# Altium schematic sheet Battery_Module.SchDoc
size A4; SheetNumber: 1; SheetTotal: 1
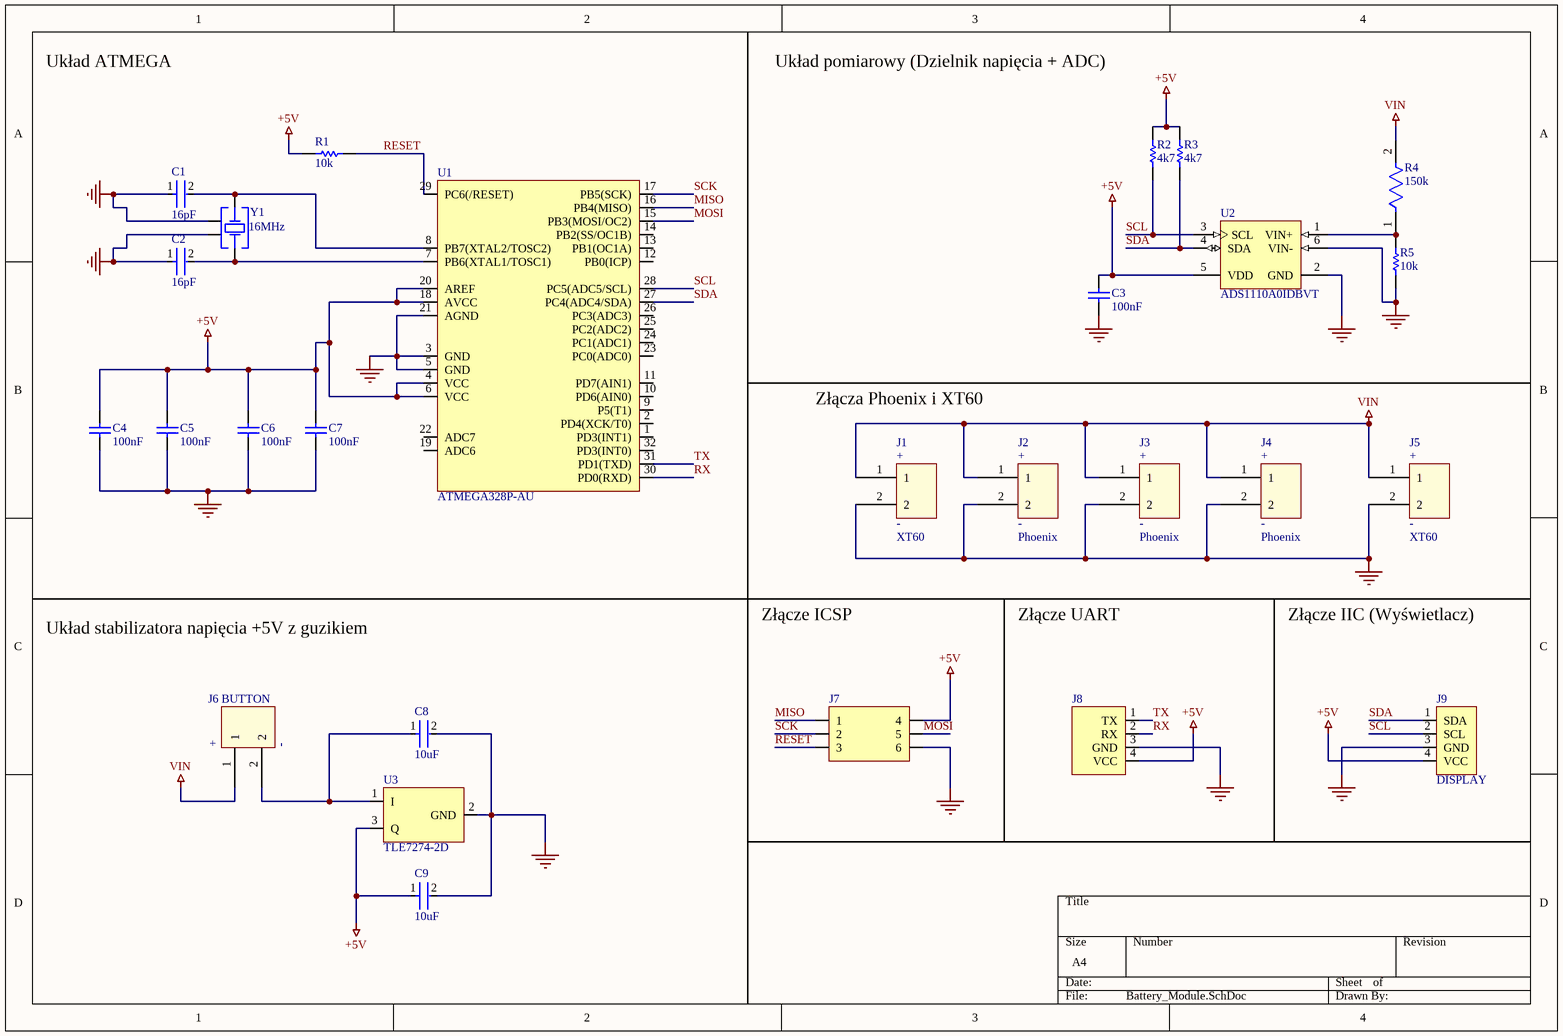
[diagram p0: Battery_Module.SchDoc]

## Parts
C1  16pF  [FP-C0805C-DN-IPC_A]
C2  16pF  [FP-C0805C-DN-IPC_A]
C3  100nF  [CAPC2013X140X50ML20T25]
C4  100nF  [CAPC2013X140X50ML20T25]
C5  100nF  [CAPC2013X140X50ML20T25]
C6  100nF  [CAPC2013X140X50ML20T25]
C7  100nF  [CAPC2013X140X50ML20T25]
C8  10uF  [FP-GRM21B-0_1-IPC_A]
C9  10uF  [FP-GRM21B-0_1-IPC_A]
J1  XT60  [XT60_FEMALE_PANEL]
J2  Phoenix  [Phoenix]
J3  Phoenix  [Phoenix]
J4  Phoenix  [Phoenix]
J5  XT60  [XT60_FEMALE_PANEL]
J6  BUTTON  [HEADER1x2]
J7  (no value)  [Header2x3 - duplicate]
J8  (no value)  [Header1x4]
J9  DISPLAY  [Header1x4]
R1  10k  [RESC2013X60X35ML10T20]
R2  4k7  [YAGO-RC0805_M]
R3  4k7  [YAGO-RC0805_M]
R4  150k  [FP-ERA6A-MFG]
R5  10k  [RESC2013X60X35ML10T20]
U1  ATMEGA328P-AU  [ATMEGA328P-AU]
U2  ADS1110A0IDBVT  [TI-DBV6_N]
U3  TLE7274-2D  [TO228P998X235-3N-2-V]
Y1  16MHz  [WE-XTAL_CFPX-180]

## Nets
+5V: C3.2 C4.1 C5.1 C6.1 C7.1 C9.1 J7.4 J8.4(VCC) J9.4(VCC) R1.2 R2.2 R3.2 U1.4(VCC) U1.6(VCC) U1.18(AVCC) U1.20(AREF) U2.5(VDD) U3.3(Q)
GND: C1.1 C2.1 C3.1 C4.2 C5.2 C6.2 C7.2 C8.2 C9.2 J1.2 J2.2 J3.2 J4.2 J5.2 J7.6 J8.3(GND) J9.3(GND) R5.1 U1.3(GND) U1.5(GND) U1.21(AGND) U2.2(GND) U2.6(VIN-) U3.2(GND) Y1.2(GND&Lid) Y1.4(GND&Lid)
VIN: J1.1 J2.1 J3.1 J4.1 J5.1 J6.1 R4.2
MISO: J7.1 U1.16(PB4(MISO))
MOSI: J7.5 U1.15(PB3(MOSI/OC2))
RESET: J7.3 R1.1 U1.29(PC6(/RESET))
RX: J8.2(RX) U1.30(PD0(RXD))
SCK: J7.2 U1.17(PB5(SCK))
SCL: J9.2(SCL) R2.1 U1.28(PC5(ADC5/SCL)) U2.3(SCL)
SDA: J9.1(SDA) R3.1 U1.27(PC4(ADC4/SDA)) U2.4(SDA)
TX: J8.1(TX) U1.31(PD1(TXD))
NetC1_2: C1.2 U1.8(PB7(XTAL2/TOSC2)) Y1.1(Crystal)
NetC2_2: C2.2 U1.7(PB6(XTAL1/TOSC1)) Y1.3(Crystal)
NetC8_1: C8.1 J6.2 U3.1(I)
NetR4_1: R4.1 R5.2 U2.1(VIN+)

Not connected (* = marked no-connect by the designer): U1 1(PD3(INT1)) 2(PD4(XCK/T0)) 9(P5(T1)) 10(PD6(AIN0)) 11(PD7(AIN1)) 12(PB0(ICP)) 13(PB1(OC1A)) 14(PB2(SS/OC1B)) 19(ADC6) 22(ADC7) 23(PC0(ADC0)) 24(PC1(ADC1)) 25(PC2(ADC2)) 26(PC3(ADC3)) 32(PD3(INT0))

## Notes on the sheet
- Układ ATMEGA
- Układ pomiarowy (Dzielnik napięcia + ADC)
- Złącza Phoenix i XT60
- Układ stabilizatora napięcia +5V z guzikiem
- Złącze ICSP
- Złącze UART
- Złącze IIC (Wyświetlacz)
- (in symbol Connector_2) +; -

## Library data of the parts
C1 C2 = CMP-03020-014624-1: C0805C160J5GACTU / CAP CER 16PF 50V NP0 0805; Manufacturer: KEMET; Temperature Coefficient: 30ppm/°C; Material: Ceramic; Tolerance: 0.05; Temperature Characteristic: C0G; RoHS: TRUE; Category: Cap; Manufacturer Part Number: C0805C160J5GACTU; Mouser Description: Capacitor, Ceramic, 16Pf, 50Vdc, 5-% Tol, 5+% Tol, C0g-Tc Code, -30, 30Ppm-Tc Rohs Compliant: Yes; Temperature: -55°C to +125°C; Digikey Description: CAP CER 16PF 50V NP0 0805; Value: 16 pF; ComponentLink2Description: Datasheet; Ipc Land Pattern Name: CAPC200125X78; Capacitance: 16 pF; Package: C0805C-DN; Device Class L1: Passive Components; Temperature Range High: +125°C; Automotive: No; Height: 0.88mm; ComponentLink2URL: https://content.kemet.com/datasheets/KEM_C1003_C0G_SMD.pdf; Octopart: https://octopart.com/c0805c160j5gactu-kemet-11800741; Lead Free: Yes; Device Class L2: Capacitors; Temperature Range Low: -55°C; Voltage Rating: 50 V; Device Class L3: Ceramic Capacitors
C3-C7 = CMP-2007-04784-1: Manufacturer: AVX Interconnect / Elco; Part Number: 08055F104KAT2A
C8 C9 = CMP-2007-03462-2: Chip Multilayer Ceramic Capacitors for General Purpose, 0805, 10uF, X6S, 22%, 10%, 10V; Width: 1.25mm; Height: 1.25mm; Case Code (Metric): 2012; REACH SVHC: No SVHC; Depth: 1.25mm; Dielectric: X6S; Max Operating Temperature: 105°C; Lead Free: Lead Free; Voltage Rating (DC): 10V; Material: Ceramic; Termination: SMD/SMT; Thickness: 0.053inch; Case/Package: 0805; Mount: Surface Mount; Voltage: 10V; Packaging: Tape and Reel; Package Quantity: 3000; Capacitance: 10uF; Radiation Hardening: No; Voltage Rating: 10V; Length: 2mm; Tolerance: 10%; Min Operating Temperature: -55°C; Case Code (Imperial): 0805
J1-J6 = Connector_2
J7 = Header 2x3
J8 = UART
J9 = IIC for Display
R1 R5 = CMP-1659-00013-4: RC0805FR-0710KL / Chip Resistor, 10 KOhm, +/- 1%, 0.125 W, -55 to 155 degC, 0805 (2012 Metric), RoHS, Tape and Reel; Manufacturer: Yageo; Voltage Rating: 150 V; Mount: Surface Mount; ComponentLink1Description: Manufacturer URL; ComponentLink2URL: http://www.yageo.com/documents/recent/PYu-RC_Group_51_RoHS_L_04.pdf; Pins: 2; Length: 2 mm; Min Operating Temperature: -55 degC; Height: 0.5 mm; Mounting Technology: Surface Mount; RoHSCompliant: true; REACH SVHC: No SVHC; ComponentLink1URL: http://www.yageo.com/; Max Operating Temperature: 155 degC; PackageReference: 0805; DatasheetVersion: Rev. 4, 02/2016; Package Quantity: 5000; Packaging: Tape and Reel; ComponentLink2Description: Datasheet; PackageDescription: 2-Pin Surface Mounted Device, Body 2 x 1.25 mm
R2 R3 = CMP-1568-00001-1: RC0805FR-074K7L / General Puprose Chip Resistor, 4700 Ohm +/- 1%, 0.125 W, -55 to 155 degC, 2-Pin SMD, RoHS, Tape and Reel; Tolerance: +/- 1%; Power: 0.125 W; PackageDescription: 2-Pin Surface Mount Device, Body 2 x 1.25 mm; ComponentLink2URL: http://www.yageo.com/documents/recent/PYu-RC_Group_51_RoHS_L-3.pdf; Temperature Min: -55 degC; Packing: Tape and Reel; Mounting Technology: Surface Mount; PartNumber: RC0805FR-074K7L; ComponentLink1URL: http://www.yageo.com/NewPortal/_en/index.jsp; Resistance: 4700 Ohm; Temperature Max: 155 degC; ComponentLink2Description: Datasheet; DatasheetVersion: Rev. 3; RoHS: TRUE; ComponentLink1Description: Manufacturer URL
R4 = CMP-2001-00599-2: ERA-6AEB154V / RES 150K OHM 0.1% 1/8W 0805; Voltage Rating: 100V; Power Rating: 125mW; Resistance: 150kR; Temperature Coefficient: 25ppm/°C; Termination: SMD/SMT; Number of Terminations: 2; Case Code (Metric): 2012; Number of Pins: 2; Radiation Hardening: No; Technology: METAL FILM; Construction: Rectangular; Contact Plating: Tin; Width: 1.25mm; Resistor Type: Thin Film; Length: 2mm; Max Power Dissipation: 125mW; Mount: Surface Mount; REACH SVHC: No SVHC; Packaging: Tape and Reel; Min Operating Temperature: -55°C; Lead Free: Lead Free; Resistance Tolerance: 0.1%; Depth: 1.25mm; RoHS Compliant: Yes; Military Standard: Not; Max Operating Temperature: 155°C; Package Quantity: 5000; Series: ERA-6A; Height: 0.5mm; Case Code (Imperial): 0805; Tolerance: 0.1%; Voltage Rating (DC): 100V; Case/Package: 0805
U1 = ATMEGA328P-AU: 8-bit Microcontrollers - MCU 32KB In-system Flash 20MHz 1.8V-5.5V
U2 = CMP-0003-00281-2: 16-Bit Delta-Sigma ADC with Internal Reference, PGA and Oscillator, I2C Serial Interface, -40 to 85 degC, 6-pin SOT23 (DBV6), Green (RoHS & no Sb/Br); Manufacturer: Texas Instruments; SubFamily: Precision ADC (<=10MSPS); Sample Rate (max)(SPS): 240; Digital Supply(Max)(V): 5.5; Interface: Serial I2C; Digital Supply(Min)(V): 2.7; Resolution(Bits): 16; # Input Channels: 1; PackageDescription: 6-Pin Plastic Small Outline, Body 1.6 x 2.9 mm, Pitch 0.95 mm; ComponentLink2Description: Datasheet; ComponentLink3URL: http://www.ti.com/litv/pdf/mpds026h; PackageReference: DBV6; ComponentLink1Description: Manufacturer URL; Analog Voltage AV/DD(Max)(V): 5.5; Mounting Technology: Surface Mount; ComponentLink3Description: Package Specification; PartNumber: ADS1110A0IDBVT; Architecture: Delta-Sigma; ComponentLink1URL: http://www.ti.com/; Code_JEDEC: MO-178; ComponentLink2URL: http://www.ti.com/general/docs/lit/getliterature.tsp?genericPartNumber=ADS1110&fileType=pdf; DatasheetVersion: SBAS276A; Analog Voltage AV/DD(Min)(V): 2.7; PackageVersion: 4073253-5/K, 03/2006; Eco-Plan: Green (RoHS & no Sb/Br)
Y1 = CMP-03913-116876453-1: 830035264 WE-XTAL Quartz Crystal; Length: 3.2mm; Height: 800µm; NexarPartId: 116876453; Max Operating Temperature: 60°C; Frequency: 16MHz; Min Operating Temperature: -10°C; Width: 2.5mm